# EasyEDA schematic SCH_tic-toc_2024-06-27.json
TITLE: Sheet_1; REV: 1.0; Date: 2024-05-16; Sheet: 1/1; Drawn By: andriushenkodenys; Company: Your Company
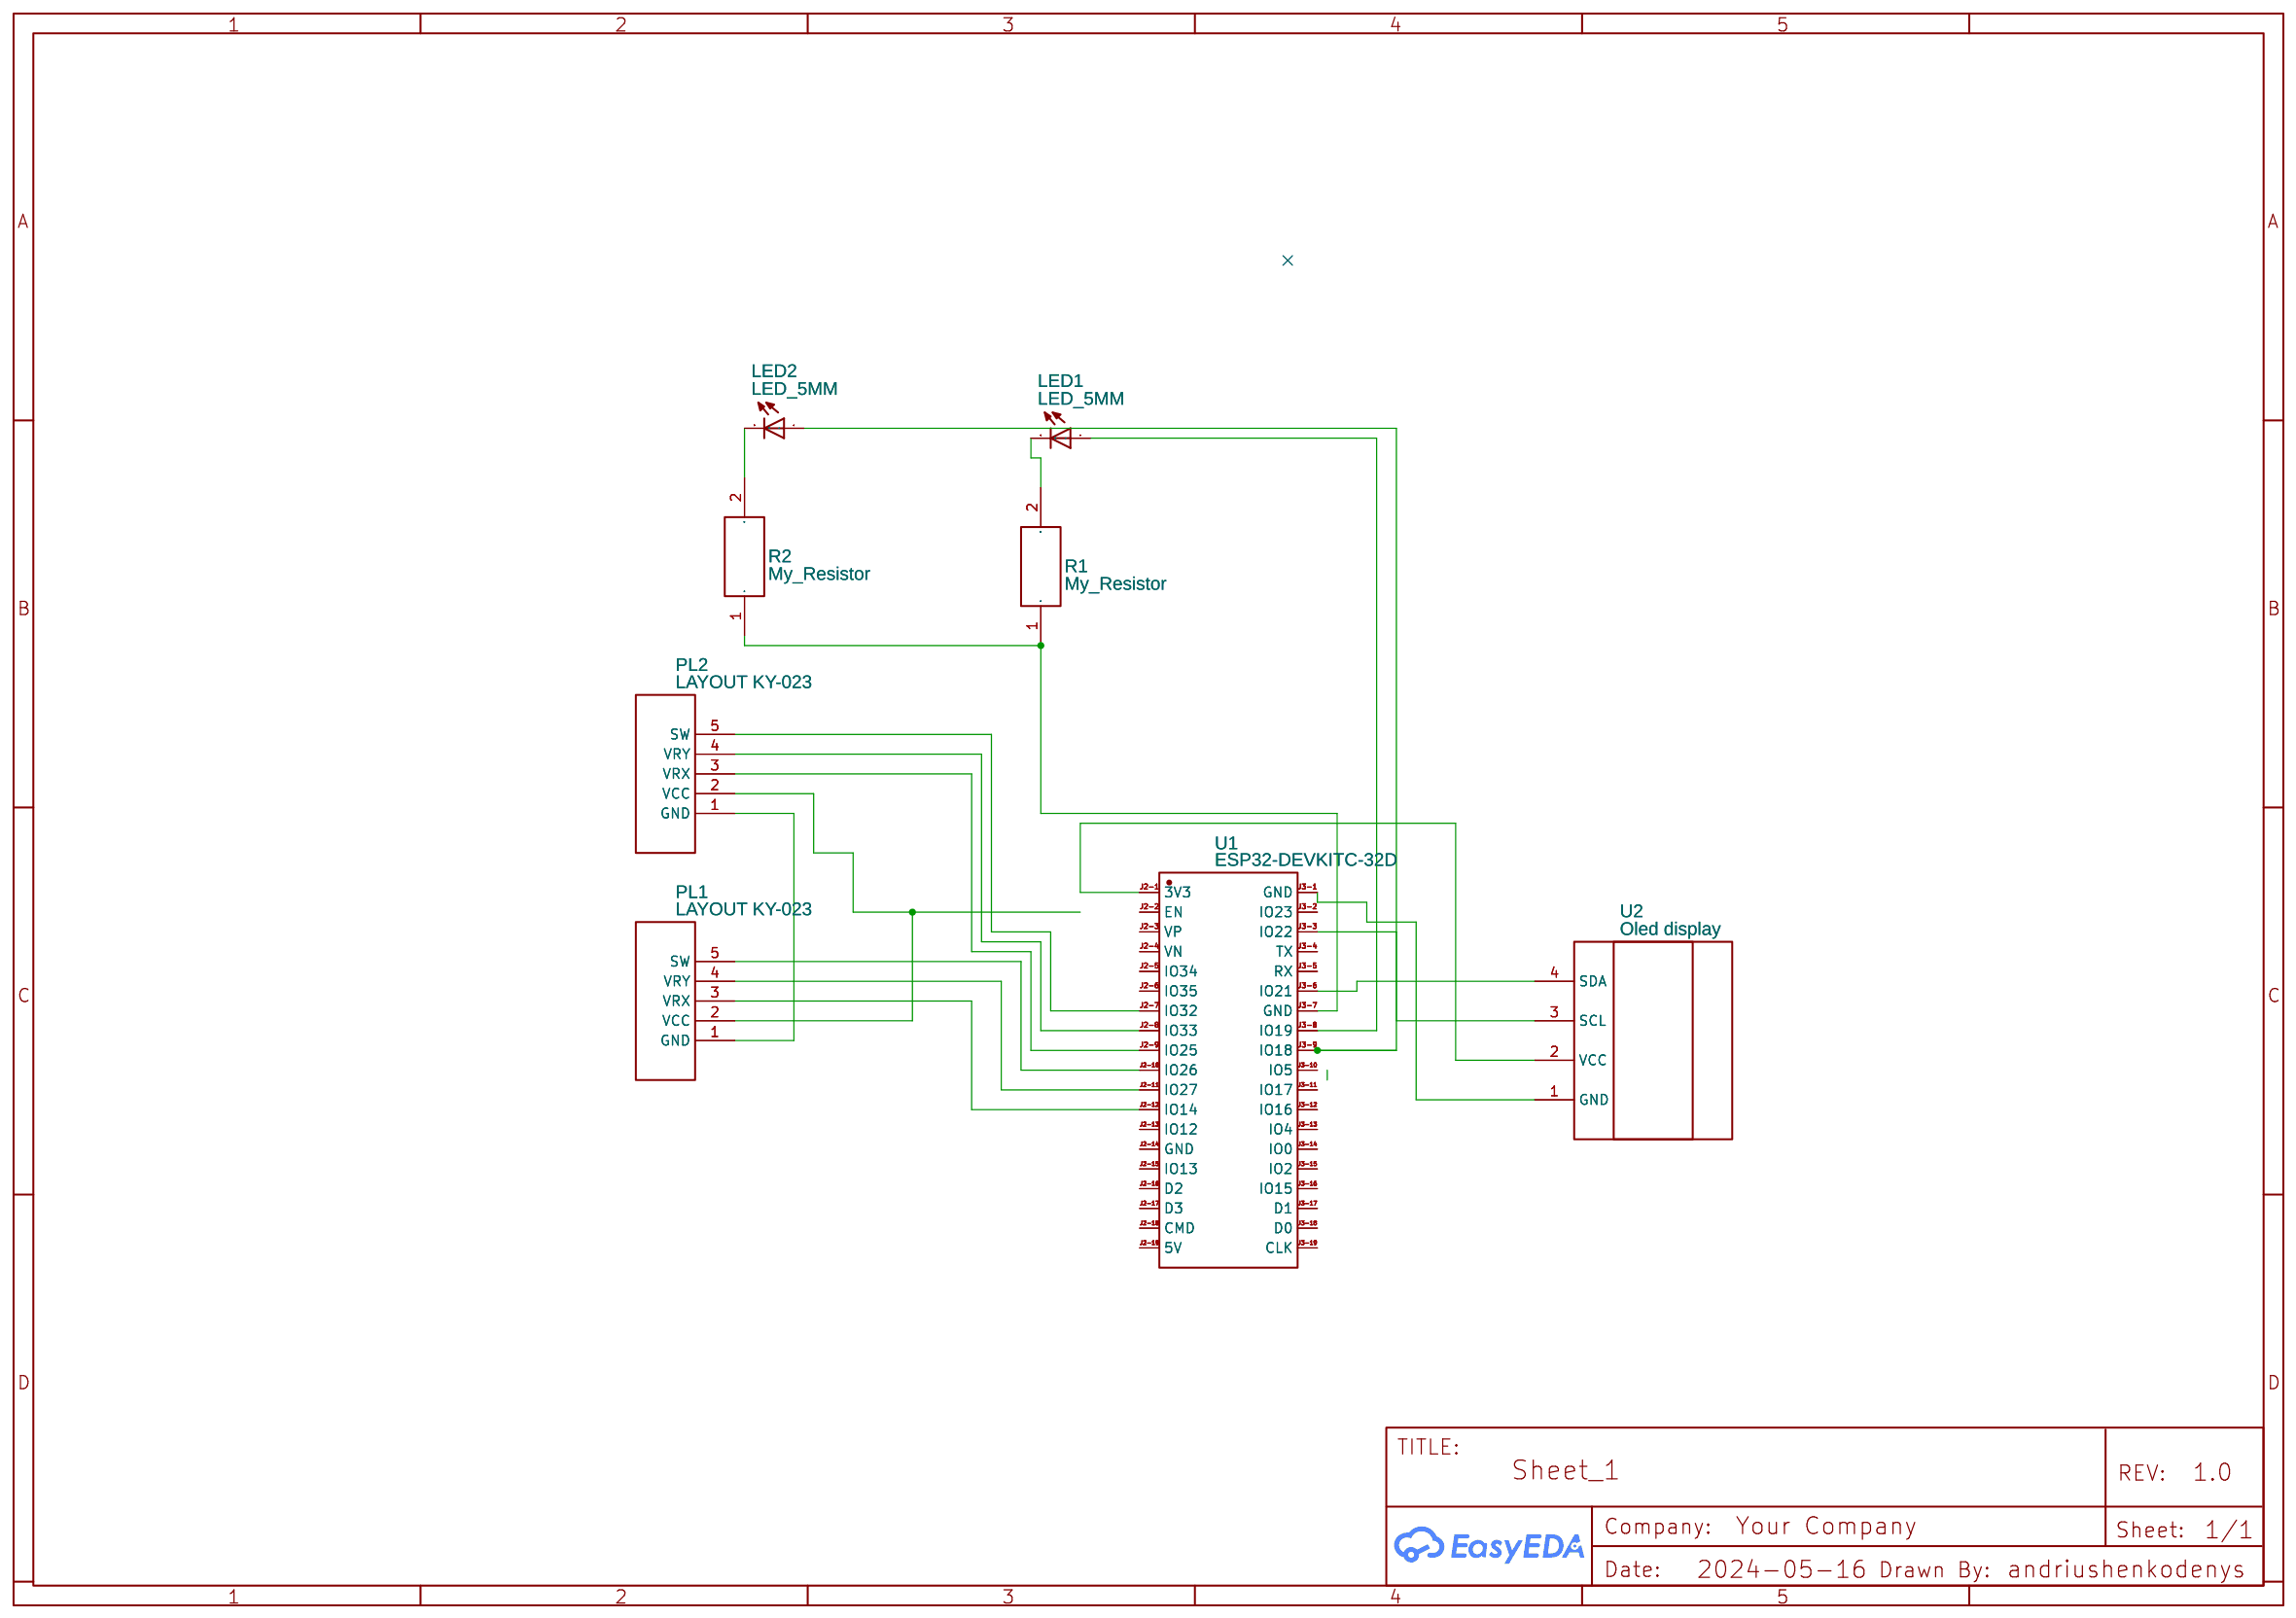
[diagram p0: schematic sheet]

## Parts
LED1  LED_5MM  [LED-5MM-5MM]
LED2  LED_5MM  [LED-5MM-5MM]
PL1  LAYOUT KY-023  [ARDUINO JOYSTICK KY-023]
PL2  LAYOUT KY-023  [ARDUINO JOYSTICK KY-023]
R1  My_Resistor  [MY_RESITOR_0.25W]
R2  My_Resistor  [MY_RESITOR_0.25W]
U1  ESP32-DEVKITC-32D  [COMM-SMD_ESP32-DEVKITC-32D]
U2  Oled display  [OLED1306]

## Library data of the parts
LED1 LED2 = LED_5MM: Contributor: Airtau
PL1 PL2 = LAYOUT KY-023: Contributor: dulinn
R1 R2 = My_Resistor: Contributor: dlg28031_ukrnet
U1 = ESP32-DEVKITC-32D: Supplier: LCSC; Supplier Part: C571181; Manufacturer: ESPRESSIF(乐鑫); Manufacturer Part: ESP32-DevKitC-32D; JLCPCB Part Class: Extended Part; Contributor: lcsc
U2 = Oled display: Contributor: kilovoctor

## Nets
Net-(LED1-1): LED1.1(A) U1.J3-8(IO19)
Net-(LED1-2): LED1.2(C) R1.2
Net-(LED2-1): LED2.1(A) U1.J3-9(IO18)
Net-(LED2-2): LED2.2(C) R2.2
Net-(PL1-1): PL1.1(GND) PL2.1(GND)
Net-(PL1-2): PL1.2(VCC) PL2.2(VCC)
Net-(PL1-3): PL1.3(VRX) U1.J2-12(IO14)
Net-(PL1-4): PL1.4(VRY) U1.J2-11(IO27)
Net-(PL1-5): PL1.5(SW) U1.J2-10(IO26)
Net-(PL2-3): PL2.3(VRX) U1.J2-9(IO25)
Net-(PL2-4): PL2.4(VRY) U1.J2-8(IO33)
Net-(PL2-5): PL2.5(SW) U1.J2-7(IO32)
Net-(R1-1): R1.1 R2.1 U1.J3-7(GND)
Net-(U1-J2-1): U1.J2-1(3V3) U2.2(VCC)
Net-(U1-J3-1): U1.J3-1(GND) U2.1(GND)
Net-(U1-J3-3): U1.J3-3(IO22) U2.3(SCL)
Net-(U1-J3-6): U1.J3-6(IO21) U2.4(SDA)

Not connected (* = marked no-connect by the designer): U1 J2-2(EN) J2-3(VP) J2-4(VN) J2-5(IO34) J2-6(IO35) J2-13(IO12) J2-14(GND) J2-15(IO13) J2-16(D2) J2-17(D3) J2-18(CMD) J2-19(5V) J3-2(IO23) J3-4(TX) J3-5(RX) J3-10(IO5) J3-11(IO17) J3-12(IO16) J3-13(IO4) J3-14(IO0) J3-15(IO2) J3-16(IO15) J3-17(D1) J3-18(D0) J3-19(CLK)
